# EAGLE design Szymon.Sochaj_schemat2 (EAGLE 9.6.0)
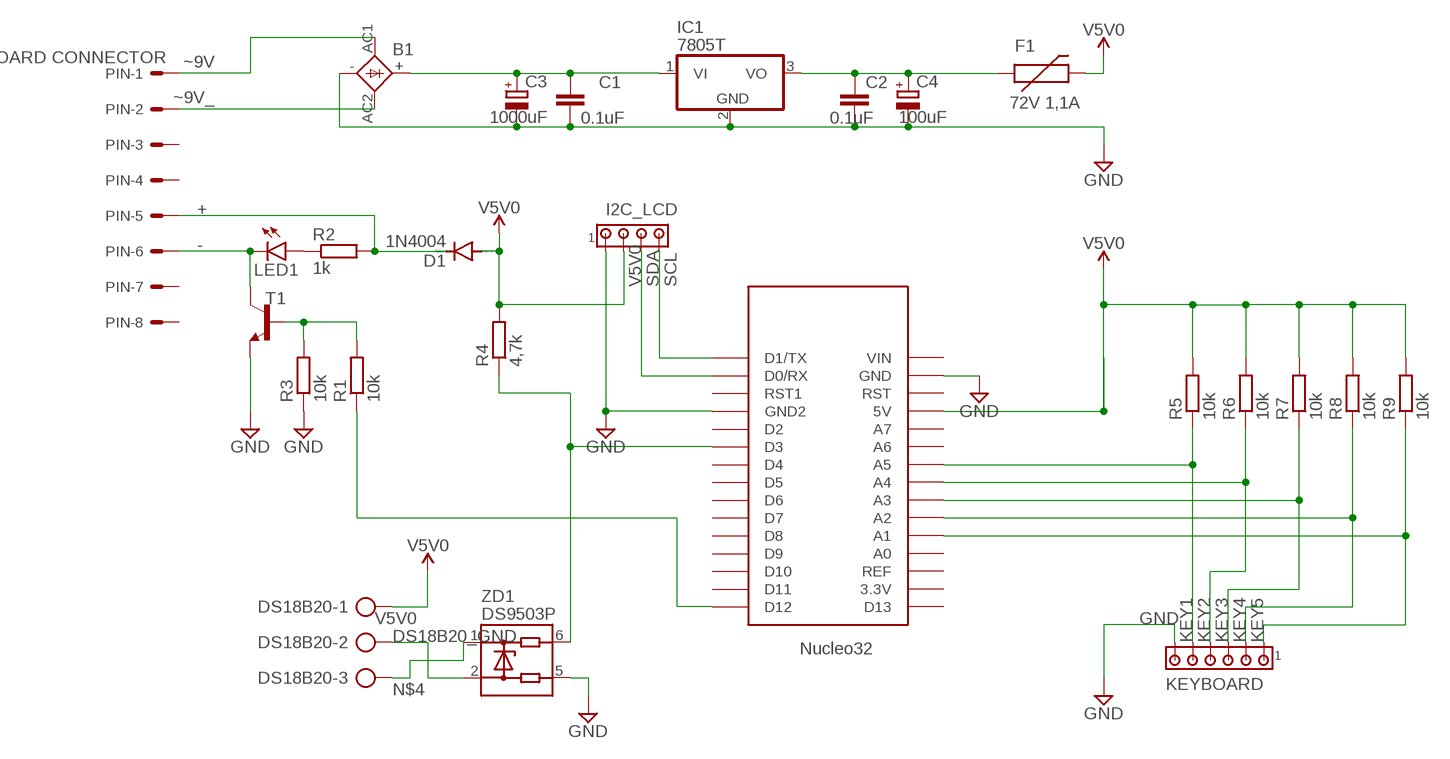
[diagram p0: schematic, sheet 1]

## Parts
B1  2KBP  [2KBP]
C1  0.1uF  0.1UF-KIT-EZ-50V-20%  [CAP-PTH-SMALL-KIT]
C2  0.1uF  0.1UF-KIT-EZ-50V-20%  [CAP-PTH-SMALL-KIT]
C3  1000uF  C-POLRADIAL-20MM-DIA  [CAPPRD550W60D1200H2000B]
C4  100uF  C-POL_RADIAL-20MM-DIA  [CAPPRD550W60D1200H2000B]
D1  1N4004  [DO41-10]
DS18B20  AK300/3  [AK300/3]
F1  72V 1,1A  PTCPTH  [PTC]
I2C_LCD  MTA04-100  [10X04MTA]
IC1  7805T  [TO220H]
KEYBOARD  MTA06-100  [10X06MTA]
LED1  LED3MM  [LED3MM]
PIN  BOARD CONNECTOR  22-05-7088-08  [7395-08]
R1  10k  R-EU_0204/5  [0204/5]
R2  1k  R-EU_0204/5  [0204/5]
R3  10k  R-EU_0204/5  [0204/5]
R4  4,7k  R-EU_0204/5  [0204/5]
R5  10k  R-EU_0204/5  [0204/5]
R6  10k  R-EU_0204/5  [0204/5]
R7  10k  R-EU_0204/5  [0204/5]
R8  10k  R-EU_0204/5  [0204/5]
R9  10k  R-EU_0204/5  [0204/5]
T1  BC337  2SC1740  [TO92-ECB]
U$1  NUCLEO32  [NUCLEO32]
ZD1  DS9503P  [TSOC6]

## Nets
+: D1.C PIN.5 R2.2
-: LED1.K(C) PIN.6 T1.C(B)
DS18B20_GND: DS18B20.2 ZD1.2
GND: B1.- C1.2 C2.2 C3.2(-) C4.2(-) I2C_LCD.1 IC1.2(GND) KEYBOARD.6 R3.1 T1.E U$1.GND U$1.GND1(GND2) ZD1.5
KEY1: KEYBOARD.5 R5.1 U$1.A5
KEY2: KEYBOARD.4 R6.1 U$1.A4
KEY3: KEYBOARD.3 R7.1 U$1.A3
KEY4: KEYBOARD.2 R8.1 U$1.A2
KEY5: KEYBOARD.1 R9.1 U$1.A1
N$1: B1.+ C1.1 C3.1(+) IC1.1(VI)
N$3: C2.1 C4.1(+) F1.P$1 IC1.3(VO)
N$4: DS18B20.3 ZD1.1
N$5: LED1.A R2.1
N$7: R1.2 R3.2 T1.B(C)
N$9: R1.1 U$1.D12
N$12: R4.1 U$1.D3 ZD1.6
SCL: I2C_LCD.4 U$1.TX0(D1/TX)
SDA: I2C_LCD.3 U$1.RX1(D0/RX)
V5V0: D1.A DS18B20.1 F1.P$2 I2C_LCD.2 R4.2 R5.2 R6.2 R7.2 R8.2 R9.2 U$1.5V
~9V: B1.AC1 PIN.1
~9V_: B1.AC2 PIN.2
Unconnected: PIN.3 PIN.4 PIN.7 PIN.8 U$1.3.3V U$1.A0 U$1.A6 U$1.A7 U$1.AREF(REF) U$1.D2 U$1.D4 U$1.D5 U$1.D6 U$1.D7 U$1.D8 U$1.D9 U$1.D10 U$1.D11 U$1.D13 U$1.ICSP1 U$1.ICSP2 U$1.ICSP3 U$1.ICSP4 U$1.ICSP5 U$1.ICSP6 U$1.RAW(VIN) U$1.RST U$1.RST1

## Library data of the parts
B1 = Szymon.Sochaj_schemat2:2KBP: RECTIFIER grid 3 x 3,81 mm
C1 C2 = Szymon.Sochaj_schemat2:0.1UF: 0.1µF ceramic capacitors A capacitor is a passive two-terminal electrical component used to store electrical energy temporarily in an electric field.; PROD_ID: CAP-08370
C3 = Szymon.Sochaj_schemat2:C-POL: Capacitor Polarised - Generic
C4 = Szymon.Sochaj_schemat2:C-POL: Capacitor Polarised - Generic; CATEGORY: Capacitor
D1 = Szymon.Sochaj_schemat2:1N4004: DIODE general purpose rectifier, 1 A
DS18B20 = Szymon.Sochaj_schemat2:AK300/3: CONNECTOR; OC_FARNELL: unknown; OC_NEWARK: unknown
F1 = Szymon.Sochaj_schemat2:PTC: Resettable Fuse PTC Resettable Fuse. Spark Fun Electronics SKU : COM-08357
I2C_LCD = Szymon.Sochaj_schemat2:MTA04-100: AMP connector
IC1 = Szymon.Sochaj_schemat2:78*: Positive VOLTAGE REGULATOR Source: http://cache.national.com/ds/LM/LM78L05.pdf http://www.fairchildsemi.com/ds/LM/LM7805.pdf
KEYBOARD = Szymon.Sochaj_schemat2:MTA06-100: AMP connector Connection corrected 2014-09-19
LED1 = Szymon.Sochaj_schemat2:LED: LED OSRAM: - CHIPLED LG R971, LG N971, LY N971, LG Q971, LY Q971, LO R971, LY R971 LH N974, LH R974 LS Q976, LO Q976, LY Q976 LO Q996 - Hyper CHIPLED LW Q18S LB Q993, LB Q99A, LB R99A - SideLED LS A670, LO A670, LY A670, LG A670, LP A670 LB A673, LV A673, LT A673, LW A673 LH A674 LY A675 LS A676, LA A676, LO A676, LY A676, LW A676 LS A679, LY A679, LG A679 - Hyper Micro SIDELED® LS Y876, LA Y876, LO Y876, LY Y876 LT Y87S - SmartLED LW L88C, LW L88S LB L89C, LB L89S, LG L890 LS L89K, LO L89K, LY L89K LS L896, LA L896, LO L896, LY L896 - TOPLED LS T670, LO T670, LY T670, LG T670, LP T670 LSG T670, LSP T670, LSY T670, LOP T670, LYG T670 LG T671, LOG T671, LSG T671 LB T673, LV T673, LT T673, LW T673 LH T674 LS T676, LA T676, LO T676, LY T676, LB T676, LH T676, LSB T676, LW T676 LB T67C, LV T67C, LT T67C, LS T67K, LO T67K, LY T67K, LW E67C LS E67B, LA E67B, LO E67B, LY E67B, LB E67C, LV E67C, LT E67C LW T67C LS T679, LY T679, LG T679 LS T770, LO T770, LY T770, LG T770, LP T770 LB T773, LV T773, LT T773, LW T773 LH T774 LS E675, LA E675, LY E675, LS T675 LS T776, LA T776, LO T776, LY T776, LB T776 LHGB T686 LT T68C, LB T68C - Hyper Mini TOPLED® LB M676 - Mini TOPLED Santana® LG M470 LS M47K, LO M47K, LY M47K Source: http://www.osram.convergy.de LUXEON: - LUMILED® LXK2-PW12-R00, LXK2-PW12-S00, LXK2-PW14-U00, LXK2-PW14-V00 LXK2-PM12-R00, LXK2-PM12-S00, LXK2-PM14-U00 LXK2-PE12-Q00, LXK2-PE12-R00, LXK2-PE12-S00, LXK2-PE14-T00, LXK2-PE14-U00 LXK2-PB12-K00, LXK2-PB12-L00, LXK2-PB12-M00, LXK2-PB14-N00, LXK2-PB14-P00, LXK2-PB14-Q00 LXK2-PR12-L00, LXK2-PR12-M00, LXK2-PR14-Q00, LXK2-PR14-R00 LXK2-PD12-Q00, LXK2-PD12-R00, LXK2-PD12-S00 LXK2-PH12-R00, LXK2-PH12-S00 LXK2-PL12-P00, LXK2-PL12-Q00, LXK2-PL12-R00 Source: www.luxeon.com KINGBRIGHT: KA-3528ASYC Source: www.kingbright.com
PIN = Szymon.Sochaj_schemat2:22-?-08: CONNECTOR wire to board 2.54 mm (.1 inch) pitch header; MF: MOLEX; OC_FARNELL: unknown; OC_NEWARK: unknown
R1-R9 = Szymon.Sochaj_schemat2:R-EU_: RESISTOR, European symbol
T1 = Szymon.Sochaj_schemat2:2SC1740: NPN Silicon Epitaxial Planar Transistor Source: SEMTECH ELECTRONICS LTD. 2SC1740.pdf
U$1 = Szymon.Sochaj_schemat2:NUCLEO32: Nucleo-32
ZD1 = Szymon.Sochaj_schemat2:DS9503: ESD Protection Diode with Resistors This ESD protection diode is designed especially for onewire host interfaces. Unlike the DS9502, it has two additional 5Ohm resitors in the 1W and GND line. Pin 5 and 6 have to be connected to the host side, pin 1 und 2 to the network side. The 1W line is through pin 1 and 6, the GND line is through pin 2 and 5. Author: Jan Kandziora <jjj@gmx.de>

## Net classes
0 default: width 0.508 mm, clearance 0.508 mm
1 V5V0: width 1.27 mm, clearance 0.406 mm

## Board
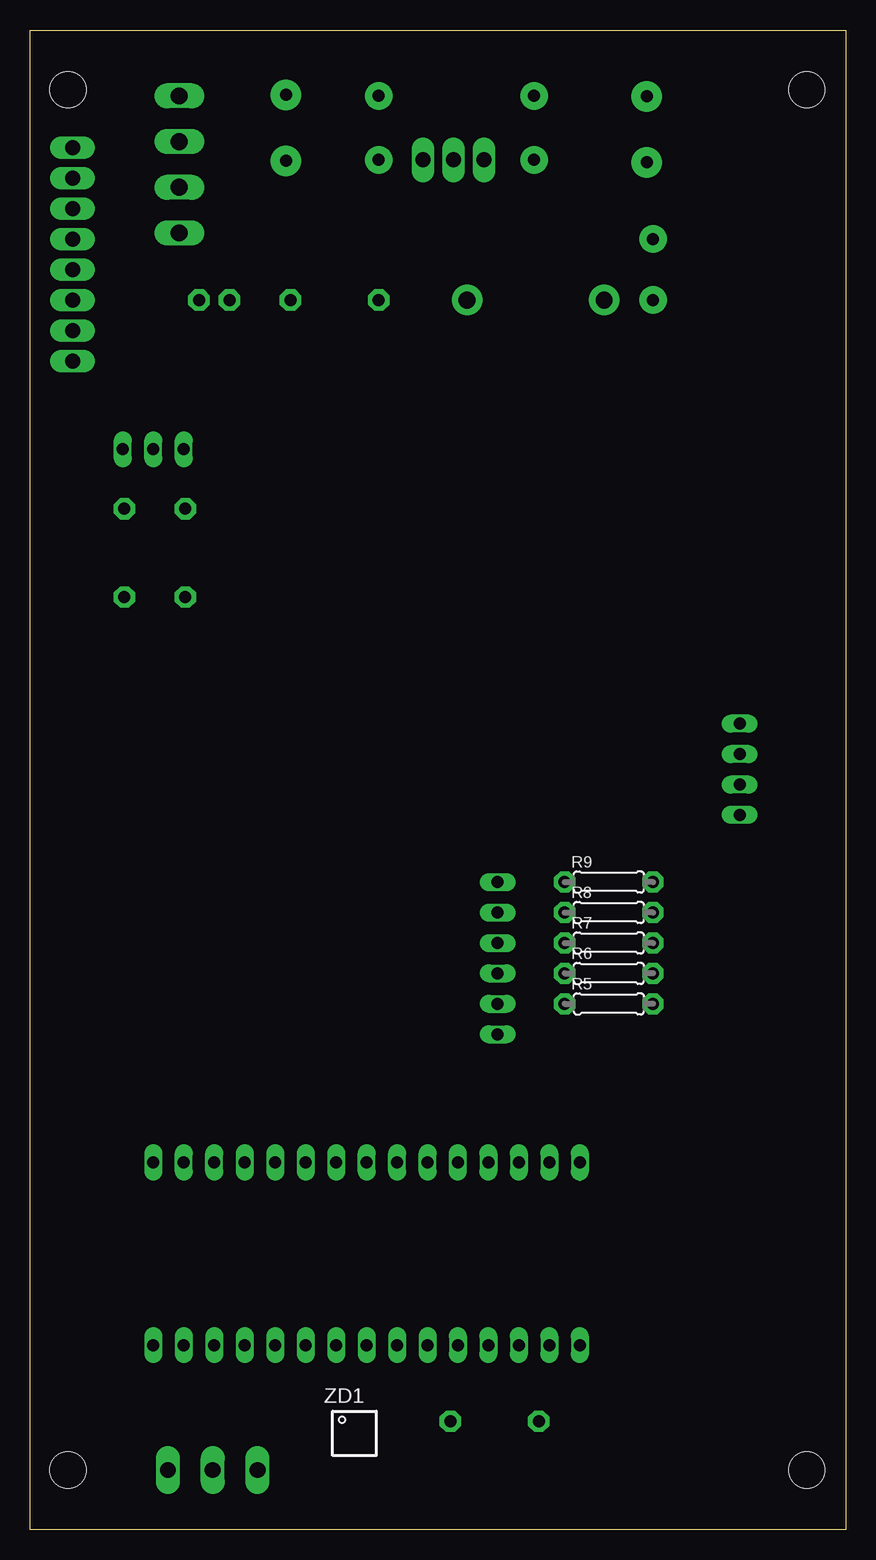
[diagram p1: board, top side]
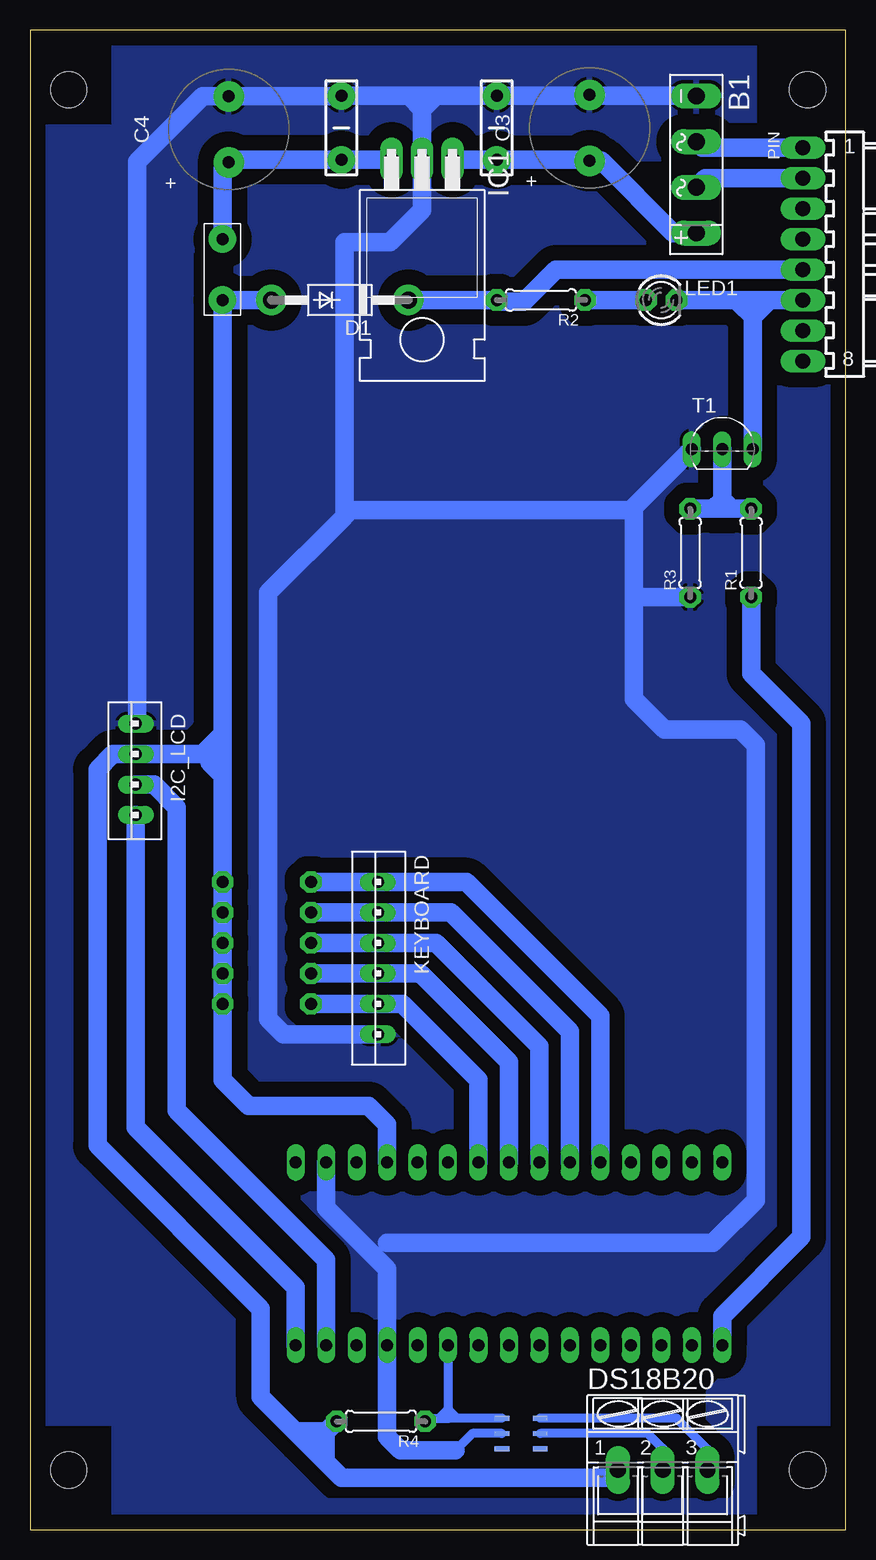
[diagram p2: board, bottom side, seen from below]

Size 68 x 125 mm. Coordinates in mm from the lower left corner, seen from the top.
Outline: 0,0 0,125 68,125 68,0 0,0
Copper layers (1*16): Top 0.035mm / dielectric 1.5mm / Bottom 0.035mm
Design rules "default *": minimum track width 14mil, minimum drill 0.5mm, track to track 12mil, track to pad 12mil, pad to pad 12mil, via to via 12mil, smd to smd 0mil, copper to edge 40mil, drill to drill 6mil, minimum pad ring 10mil, minimum via ring 8mil, stop-mask expansion 4mil, vias tented up to drill 0mil, thermal gap 10mil
Holes 3 mm at 64.77,120.02 3.17,120.02 3.17,4.95 64.77,4.95

### Footprints (pad centres in the part's own frame; a part is rotated, then mirrored left to right if it is on the bottom)
2KBP = drill 1.4 long: + 5.715,0; - -5.715,0; AC1 -1.905,0; AC2 1.905,0
CAP-PTH-SMALL-KIT = drill 1 pad 2.286: 1 -2.667,0; 2 2.667,0
CAPPRD550W60D1200H2000B = drill 1 pad 2.54: 1 -2.75,0; 2 2.75,0
DO41-10 = drill 1.4 pad 2.54: A 5.08,0; C -6.35,0
AK300/3 = drill 1.321 long: 1 -3.734,0; 2 0,0; 3 3.734,0
PTC = drill 1 pad 2.286: P$1 -2.54,0; P$2 2.54,0
10X04MTA = drill 1 long: 1 3.302,0.889; 2 0.762,0.889; 3 -1.778,0.889; 4 -4.318,0.889
TO220H = drill 1.25 long: 1 -2.54,-10.16; 2 0,-10.16; 3 2.54,-10.16
10X06MTA = drill 1 long: 1 5.08,1.016; 2 2.54,1.016; 3 0,1.016; 4 -2.54,1.016; 5 -5.08,1.016; 6 -7.62,1.016
LED3MM = drill 1 pad 1.778 octagon: A -1.27,0; K 1.27,0
7395-08 = drill 1.25 long: 1 8.89,0; 2 6.35,0; 3 3.81,0; 4 1.27,0; 5 -1.27,0; 6 -3.81,0; 7 -6.35,0; 8 -8.89,0
0204/5 = drill 1 pad 1.778 octagon: 1 -4.826,0; 2 2.54,0
TO92-ECB = drill 1 long: B 0,0; C 2.54,0; E -2.54,0
NUCLEO32 = drill 1 long: 3.3V -10.16,24.13; 5V -10.16,-1.27; A0 -10.16,19.05; A1 -10.16,16.51; A2 -10.16,13.97; A3 -10.16,11.43; A4 -10.16,8.89; A5 -10.16,6.35; A6 -10.16,3.81; A7 -10.16,1.27; AREF -10.16,21.59; D2 5.08,1.27; D3 5.08,3.81; D4 5.08,6.35; D5 5.08,8.89; D6 5.08,11.43; D7 5.08,13.97; D8 5.08,16.51; D9 5.08,19.05; D10 5.08,21.59; D11 5.08,24.13; D12 5.08,26.67; D13 -10.16,26.67; GND -10.16,-6.35; GND1 5.08,-1.27; RAW -10.16,-8.89; RST -10.16,-3.81; RST1 5.08,-3.81; RX1 5.08,-6.35; TX0 5.08,-8.89 | drill 0 pad 0: ICSP1 -8.89,-8.89; ICSP2 -8.89,-8.89; ICSP3 -8.89,-8.89; ICSP4 -8.89,-8.89; ICSP5 -8.89,-8.89; ICSP6 -8.89,-8.89
TSOC6 = smd 1.219 x 0.406 bottom: 1 -1.6,1.27; 2 -1.6,0; 3 -1.6,-1.27; 4 1.6,-1.27; 5 1.6,0; 6 1.6,1.27

### Placement (x,y rotation side)
B1  12.45,113.79 270 bottom
C1  29.08,116.84 90 bottom
C2  42.04,116.84 90 bottom
C3  21.34,116.84 90 bottom
C4  51.44,116.71 90 bottom
D1  42.8,102.49 180 bottom
DS18B20  15.24,4.95 0 bottom
F1  51.94,105.03 270 bottom
I2C_LCD  58.29,63.88 90 bottom
IC1  35.31,104.01 180 bottom
KEYBOARD  37.97,48.9 90 bottom
LED1  15.37,102.49 0 bottom
PIN  3.56,106.3 90 bottom
R1  7.87,82.55 90 bottom
R2  26.54,102.49 180 bottom
R3  12.95,82.55 90 bottom
R4  39.88,9.02 180 bottom
R5  49.4,43.81 0 top
R6  49.4,46.35 0 top
R7  49.4,48.9 0 top
R8  49.4,51.44 0 top
R9  49.4,53.98 0 top
T1  10.29,90.04 0 bottom
U$1  36.96,20.45 270 bottom
ZD1  27.05,8 0 top

### Tracks (layer width: path | path; a pad name or v marks a point on that pad's centre or on a via)
+
  Bottom 1.524: PIN.5 24.13,105.03 26.8,102.36 28.96,102.36 R2.2 D1.C
-
  Bottom 1.524: LED1.K 8.89,102.49 | 8.89,102.49 8.64,102.49 | 8.64,102.49 7.62,102.49 | 7.62,102.49 6.35,102.49 | 6.35,102.49 PIN.6 | 7.62,102.49 7.75,102.36 7.75,101.6 | T1.C 7.75,101.09 | 7.75,101.09 7.75,101.6 | 7.75,101.6 8.64,102.49 | 6.35,102.49 7.75,101.09 | 8.89,102.49 8.89,102.23 7.75,101.09
DS18B20_GND
  Bottom 0.762: 15.24,6.73 16.51,8 ZD1.2
  Bottom 0.813: DS18B20.2 15.24,6.73
GND
  Bottom 0.762: 32.51,6.6 31.11,8 ZD1.5
  Bottom 1.524: B1.- 21.25,119.51 | 21.25,119.51 C3.2 | 21.25,119.51 C1.2 34.16,119.51 | C2.2 36.45,119.51 | 35.31,118.36 IC1.2 35.31,109.98 37.97,107.31 41.78,107.31 41.78,84.45 | 36.45,119.51 35.31,118.36 | 35.31,118.36 34.16,119.51 | 42.08,119.46 C4.2 53.59,119.46 59.05,114 59.05,67.31 I2C_LCD.1 | 17.65,84.96 41.27,84.96 41.78,84.45 | 17.65,77.72 17.65,69.22 15.11,66.67 8.76,66.67 7.49,65.41 7.49,27.43 11.05,23.88 38.23,23.88 | 17.65,77.72 17.65,84.96 | KEYBOARD.6 46.86,41.27 48.13,42.55 48.13,78.11 41.78,84.45 | U$1.GND 43.31,26.8 38.23,21.72 U$1.GND1 38.23,7.75 37.08,6.6 32.51,6.6 | 34.16,119.51 36.45,119.51 | R3.1 17.65,77.72 | T1.E 17.65,85.22 17.65,84.96
  Bottom 2.032: 42.08,119.46 C2.2
  pour Bottom (isolate 1.27): 0,116.84 7.62,116.84 7.62,124.46 60.96,124.46 60.96,116.84 67.31,116.84 67.31,106.68 53.34,106.68 52.07,107.95 52.07,114.3 12.7,114.3 0,114.3
  pour Bottom (isolate 1.27): 67.31,106.68 67.31,8.89 60.96,8.89 60.96,0 7.62,0 7.62,8.89 0,8.89 0,22.86 3.81,22.86 8.89,17.78 8.89,13.97 11.43,11.43 11.43,2.54 40.64,2.54 49.53,11.43 49.53,17.78 63.5,31.75 63.5,63.5 60.96,66.04 60.96,106.68
  pour Bottom (isolate 1.27): 54.61,106.68 54.61,67.31 55.88,66.04 64.77,66.04 64.77,106.68
  pour Bottom (isolate 1.27): 15.24,106.68 21.59,113.03 50.8,113.03 50.8,38.1 48.26,35.56 40.64,35.56 39.37,34.29 38.1,34.29 38.1,33.02 31.75,33.02 31.75,36.83 36.83,41.91 45.72,41.91 45.72,54.61 44.45,55.88 31.75,55.88 19.05,43.18 19.05,33.02 8.89,33.02 8.89,29.21 10.16,27.94 46.99,27.94 41.91,22.86 41.91,17.78 8.89,17.78 7.62,16.51 0,16.51 0,102.87 2.54,105.41 15.24,105.41
  pour Bottom (isolate 0.61): 8.76,1.4 45.59,1.4 44.45,2.54 8.89,2.54 8.76,2.41
KEY1
  Bottom 1.524: U$1.A5 30.61,37.47 36.96,43.81 KEYBOARD.5 R5.1
KEY2
  Bottom 1.524: R6.1 KEYBOARD.4 35.43,46.35 28.07,38.99 U$1.A4
KEY3
  Bottom 1.524: R7.1 KEYBOARD.3 34.16,48.9 25.53,40.26 U$1.A3
KEY4
  Bottom 1.524: R8.1 KEYBOARD.2 32.89,51.44 22.99,41.53 U$1.A2
KEY5
  Bottom 1.524: R9.1 KEYBOARD.1 31.62,53.98 20.45,42.8 U$1.A1
N$1
  Bottom 1.524: B1.+ 14.35,108.08 20.36,114.09 C3.1 21.42,114.17 C1.1 IC1.1
N$3
  Bottom 1.524: IC1.3 C2.1 51.23,114.17 C4.1 51.94,113.45 F1.P$1
N$4
  Bottom 0.762: ZD1.1 14.1,9.27 11.51,6.68
  Bottom 0.813: DS18B20.3 11.51,6.68
N$5
  Bottom 1.524: R2.1 LED1.A
N$7
  Bottom 1.524: R1.2 9.53,85.09 | 9.53,85.09 10.41,85.09 | 10.41,85.09 11.05,85.09 | 11.05,85.09 R3.2 | 10.41,85.09 10.29,85.22 10.29,85.85 | T1.B 10.29,85.85 | 10.29,85.85 9.53,85.09 | 10.29,85.85 11.05,85.09
N$9
  Bottom 1.524: R1.1 7.87,71.37 3.68,67.18 3.68,24.38 10.29,17.78 U$1.D12
N$12
  Bottom 0.762: 33.91,9.27 34.8,9.27 R4.1 | 33.91,9.27 33.02,9.27 | ZD1.6 32.38,9.27 | 32.38,9.27 33.02,9.27 | U$1.D3 33.15,10.03 | 33.15,10.03 33.15,9.4 33.02,9.27 | 33.15,10.03 32.38,9.27 | 33.15,10.03 33.91,9.27
SCL
  Bottom 1.524: I2C_LCD.4 59.18,33.53 45.85,20.19 U$1.TX0
SDA
  Bottom 1.524: U$1.RX1 43.31,22.48 55.75,34.92 55.75,60.2 57.66,62.1 I2C_LCD.3
V5V0
  Bottom 1.524: D1.A F1.P$2 51.94,66.29 | 53.02,65.22 53.59,64.64 I2C_LCD.2 61.09,64.64 62.36,63.37 62.36,32 48.77,18.41 48.77,11.05 45.91,8.19 | 53.02,65.22 51.94,66.29 | 51.94,66.29 51.94,62.87 | 51.94,62.87 R9.2 R8.2 R7.2 R6.2 R5.2 51.94,37.47 49.78,35.31 39.75,35.31 38.23,33.78 U$1.5V | 53.02,65.22 53.02,63.94 51.94,62.87 | 43.37,5.65 42.04,4.32 19.61,4.32 DS18B20.1 | 43.37,5.65 44.45,6.73 | 44.45,6.73 45.28,7.56 | 45.28,7.56 45.91,8.19 | R4.2 43.88,7.56 | 43.88,7.56 44.45,6.99 44.45,6.73 | 45.28,7.56 43.88,7.56 | 43.37,5.65 43.37,8.06 R4.2 | R4.2 43.24,8.19 45.91,8.19
~9V
  Bottom 1.524: PIN.1 11.94,115.19 B1.AC1
~9V_
  Bottom 1.524: PIN.2 11.68,112.65 B1.AC2